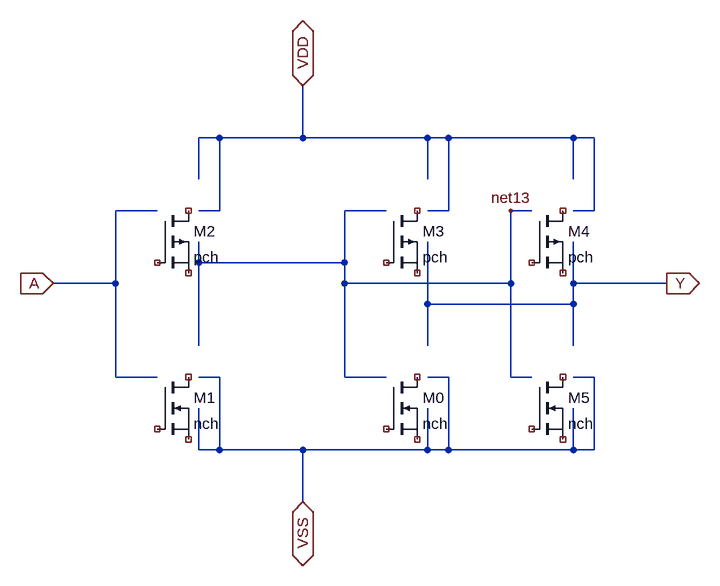
[diagram p0: schematic clkbuf2.asc]
clkbuf2.asc, the LTspice schematic file:
Version 4
SHEET 1 1120 832
WIRE 192 544 192 400
WIRE 96 400 192 400
WIRE 192 400 192 288
WIRE 192 288 256 288
WIRE 192 544 256 544
WIRE 320 496 320 368
WIRE 544 400 544 368
WIRE 800 288 832 288
WIRE 800 544 832 544
WIRE 800 400 800 288
WIRE 544 400 800 400
WIRE 544 544 544 400
WIRE 800 544 800 400
WIRE 544 288 608 288
WIRE 320 368 320 336
WIRE 544 544 608 544
WIRE 544 368 544 288
WIRE 320 368 544 368
WIRE 672 432 672 336
WIRE 896 432 896 400
WIRE 672 432 896 432
WIRE 896 400 896 336
WIRE 896 496 896 432
WIRE 896 400 1040 400
WIRE 672 496 672 432
WIRE 704 656 896 656
WIRE 896 656 928 656
WIRE 928 656 928 544
WIRE 896 544 928 544
WIRE 896 656 896 592
WIRE 480 656 480 736
WIRE 480 656 672 656
WIRE 352 656 352 544
WIRE 352 656 480 656
WIRE 320 544 352 544
WIRE 672 656 704 656
WIRE 704 656 704 544
WIRE 672 544 704 544
WIRE 672 656 672 592
WIRE 320 656 352 656
WIRE 320 656 320 592
WIRE 704 176 896 176
WIRE 896 176 928 176
WIRE 928 288 928 176
WIRE 896 288 928 288
WIRE 896 240 896 176
WIRE 480 96 480 176
WIRE 480 176 672 176
WIRE 672 176 704 176
WIRE 704 288 704 176
WIRE 672 288 704 288
WIRE 352 288 352 176
WIRE 352 176 480 176
WIRE 320 288 352 288
WIRE 672 240 672 176
WIRE 320 176 352 176
WIRE 320 240 320 176
FLAG 800 288 net13
SYMBOL PMOS 832 288 R0
SYMATTR InstName M4
SYMATTR Value pch
SYMATTR Value2 w=6u l=1u
SYMBOL PMOS 608 288 R0
SYMATTR InstName M3
SYMATTR Value pch
SYMATTR Value2 w=6u l=1u
SYMBOL PMOS 256 288 R0
SYMATTR InstName M2
SYMATTR Value pch
SYMATTR Value2 w=6u l=1u
SYMBOL NMOS 832 544 R0
SYMATTR InstName M5
SYMATTR Value nch
SYMATTR Value2 w=2.4u l=1u
SYMBOL NMOS 256 544 R0
SYMATTR InstName M1
SYMATTR Value nch
SYMATTR Value2 w=2.4u l=1u
SYMBOL NMOS 608 544 R0
SYMATTR InstName M0
SYMATTR Value nch
SYMATTR Value2 w=2.4u l=1u
FLAG 1040 400 Y
IOPIN 1040 400 Out
FLAG 480 736 VSS
IOPIN 480 736 BiDir
FLAG 480 96 VDD
IOPIN 480 96 BiDir
FLAG 96 400 A
IOPIN 96 400 In

The netlist it stands for:
* clkbuf2.asc
* M4: pch w=6u l=1u (symbol PMOS not certain, pin order unknown); nets seen at it: 
* M3: pch w=6u l=1u (symbol PMOS not certain, pin order unknown); nets seen at it: 
* M2: pch w=6u l=1u (symbol PMOS not certain, pin order unknown); nets seen at it: 
* M5: nch w=2.4u l=1u (symbol NMOS not certain, pin order unknown); nets seen at it: 
* M1: nch w=2.4u l=1u (symbol NMOS not certain, pin order unknown); nets seen at it: 
* M0: nch w=2.4u l=1u (symbol NMOS not certain, pin order unknown); nets seen at it: 
.backanno
.end